# Altium schematic sheet Driver.SchDoc
size A4; SheetNumber: 2; SheetTotal: 4
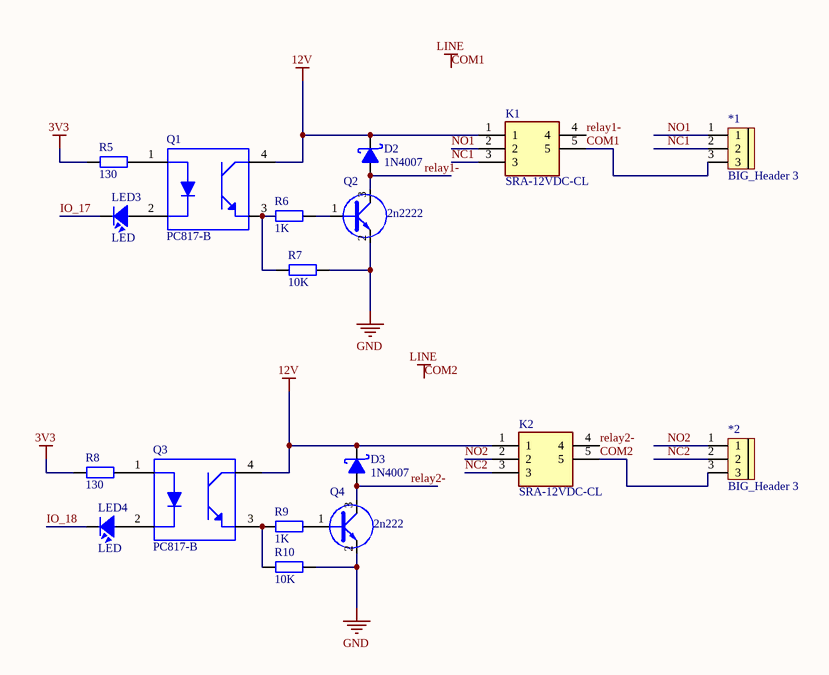
[diagram p0: Driver.SchDoc]

## Parts
*1  BIG_Header 3  [KF-128_3P]
*2  BIG_Header 3  [KF-128_3P]
D2  1N4007  [SMA]
D3  1N4007  [SMA]
K1  SRA-12VDC-CL  [SRA12VDCCL]
K2  SRA-12VDC-CL  [SRA12VDCCL]
LED3  LED  [LED-0805-Green]
LED4  LED  [LED-0805-Green]
Q1  PC817-B  [DIP4/W0.3]
Q2  2n2222  [SOT23]
Q3  PC817-B  [DIP4/W0.3]
Q4  2n222  [SOT23]
R5  130  [RES-SMD-0805]
R6  1K  [RES-SMD-0805]
R7  10K  [RES-SMD-0805]
R8  130  [RES-SMD-0805]
R9  1K  [RES-SMD-0805]
R10  10K  [RES-SMD-0805]

## Nets
3V3: R5.2 R8.2
12V: D2.2(K) D3.2(K) K1.1 K2.1 Q1.4(COLLECTOR) Q3.4(COLLECTOR)
COM1: *1.3 *2.3 K1.5 K2.5  [also labelled COM2, LINE]
GND: Q2.2(E) Q4.2(E) R7.1 R10.1
IO_17: LED3.2
IO_18: LED4.2
NC1: *1.2 K1.3
NC2: *2.2 K2.3
NO1: *1.1 K1.2
NO2: *2.1 K2.2
relay1-: D2.1(A) K1.4 Q2.3(C)
relay2-: D3.1(A) K2.4 Q4.3(C)
NetLED3_1: LED3.1 Q1.2(CATHODE)
NetLED4_1: LED4.1 Q3.2(CATHODE)
NetQ1_1: Q1.1(ANODE) R5.1
NetQ1_3: Q1.3(EMITTER) R6.2 R7.2
NetQ2_1: Q2.1(B) R6.1
NetQ3_1: Q3.1(ANODE) R8.1
NetQ3_3: Q3.3(EMITTER) R9.2 R10.2
NetQ4_1: Q4.1(B) R9.1

## Library data of the parts
D2 D3 = 1N5822: https://linhkien.cxt.vn/1119-1n4007-m7-diode-chinh-luu-1a-1000v-smado-214ac-10c.html; Value: Diode c?m 1N5408
K1 K2 = SRA-12VDC-CL: https://linhkien.cxt.vn/3210-sra-12vdc-cl-songle-relay-20a-12vdc-5-chan.html; Manufacturer_Name: Songle Relay; Height: 14mm; Manufacturer_Part_Number: SRA-12VDC-CL
LED3 LED4 = LED: LED Single colour Green and Red; Value: LED 3 ly Single Colour
Q1 Q3 = PC817-B: https://linhkien.cxt.vn/10328-pc817-dip4.html; MF: American Bright; SnapEDA_Link: https://www.snapeda.com/parts/PC817-B/American%20Bright/view-part/524587/?ref=snap; Availability: Unavailable; MP: PC817-B; Value: *; Price: None; Package: DIP-4 American Bright
Q2 Q4 = C1815: https://linhkien.cxt.vn/2040-2n2222-1p-npn-transistor-600ma-40v-sot-23-10c.html; Value: C1815
R5 R8 = Resistor - SMD: https://linhkien.cxt.vn/2109-dien-tro-130r-0805-5-50c.html; Manufacturer: Generic Components; Class: Passive; Published: 08/06/2000; Publisher: Altium Hobart Technology Centre
R6 R9 = Resistor - SMD: https://linhkien.cxt.vn/6152-dien-tro-174k-0805-1-50c.html; Manufacturer: Generic Components; Class: Passive; Published: 08/06/2000; Publisher: Altium Hobart Technology Centre
R7 = Resistor - SMD: Resistor SMD; Manufacturer: Generic Components; Class: Passive; Published: 08/06/2000; Publisher: Altium Hobart Technology Centre
R10 = Resistor - SMD: 17.4K; Manufacturer: Generic Components; Class: Passive; Published: 08/06/2000; Publisher: Altium Hobart Technology Centre